# Altium schematic sheet Reset.SchDoc
size A
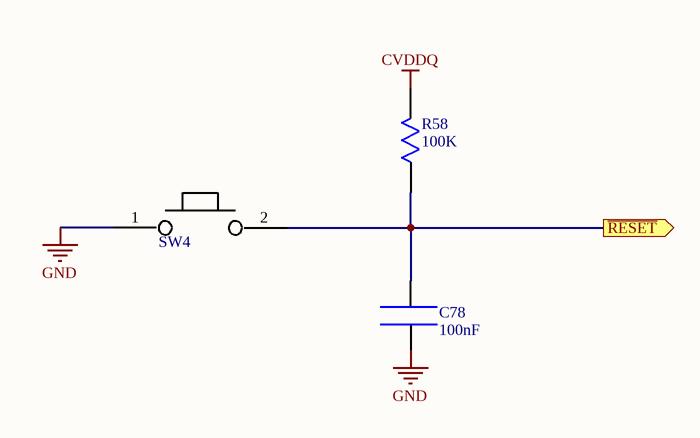
[diagram p0: Reset.SchDoc]

## Parts
C78  value 100nF  [SMD Capacitor 0603]  (hidden comment: Capacitor)
R58  value 100K  [SMD Resistor 0603]  (hidden comment: Resistor)
SW4  PB_Switch  [EVQPAC07K]  (value not drawn)

## Ports
~{RESET} (out)

## Nets
CVDDQ: R58.1
GND: C78.0 SW4.1
~{RESET}: C78.1 R58.0 SW4.2 ; port ~{RESET}

## Library data of the parts
SW4 = PB_Switch: Push Button Switch